# EAGLE design aquarium-controller-ultimate (EAGLE 6.1)
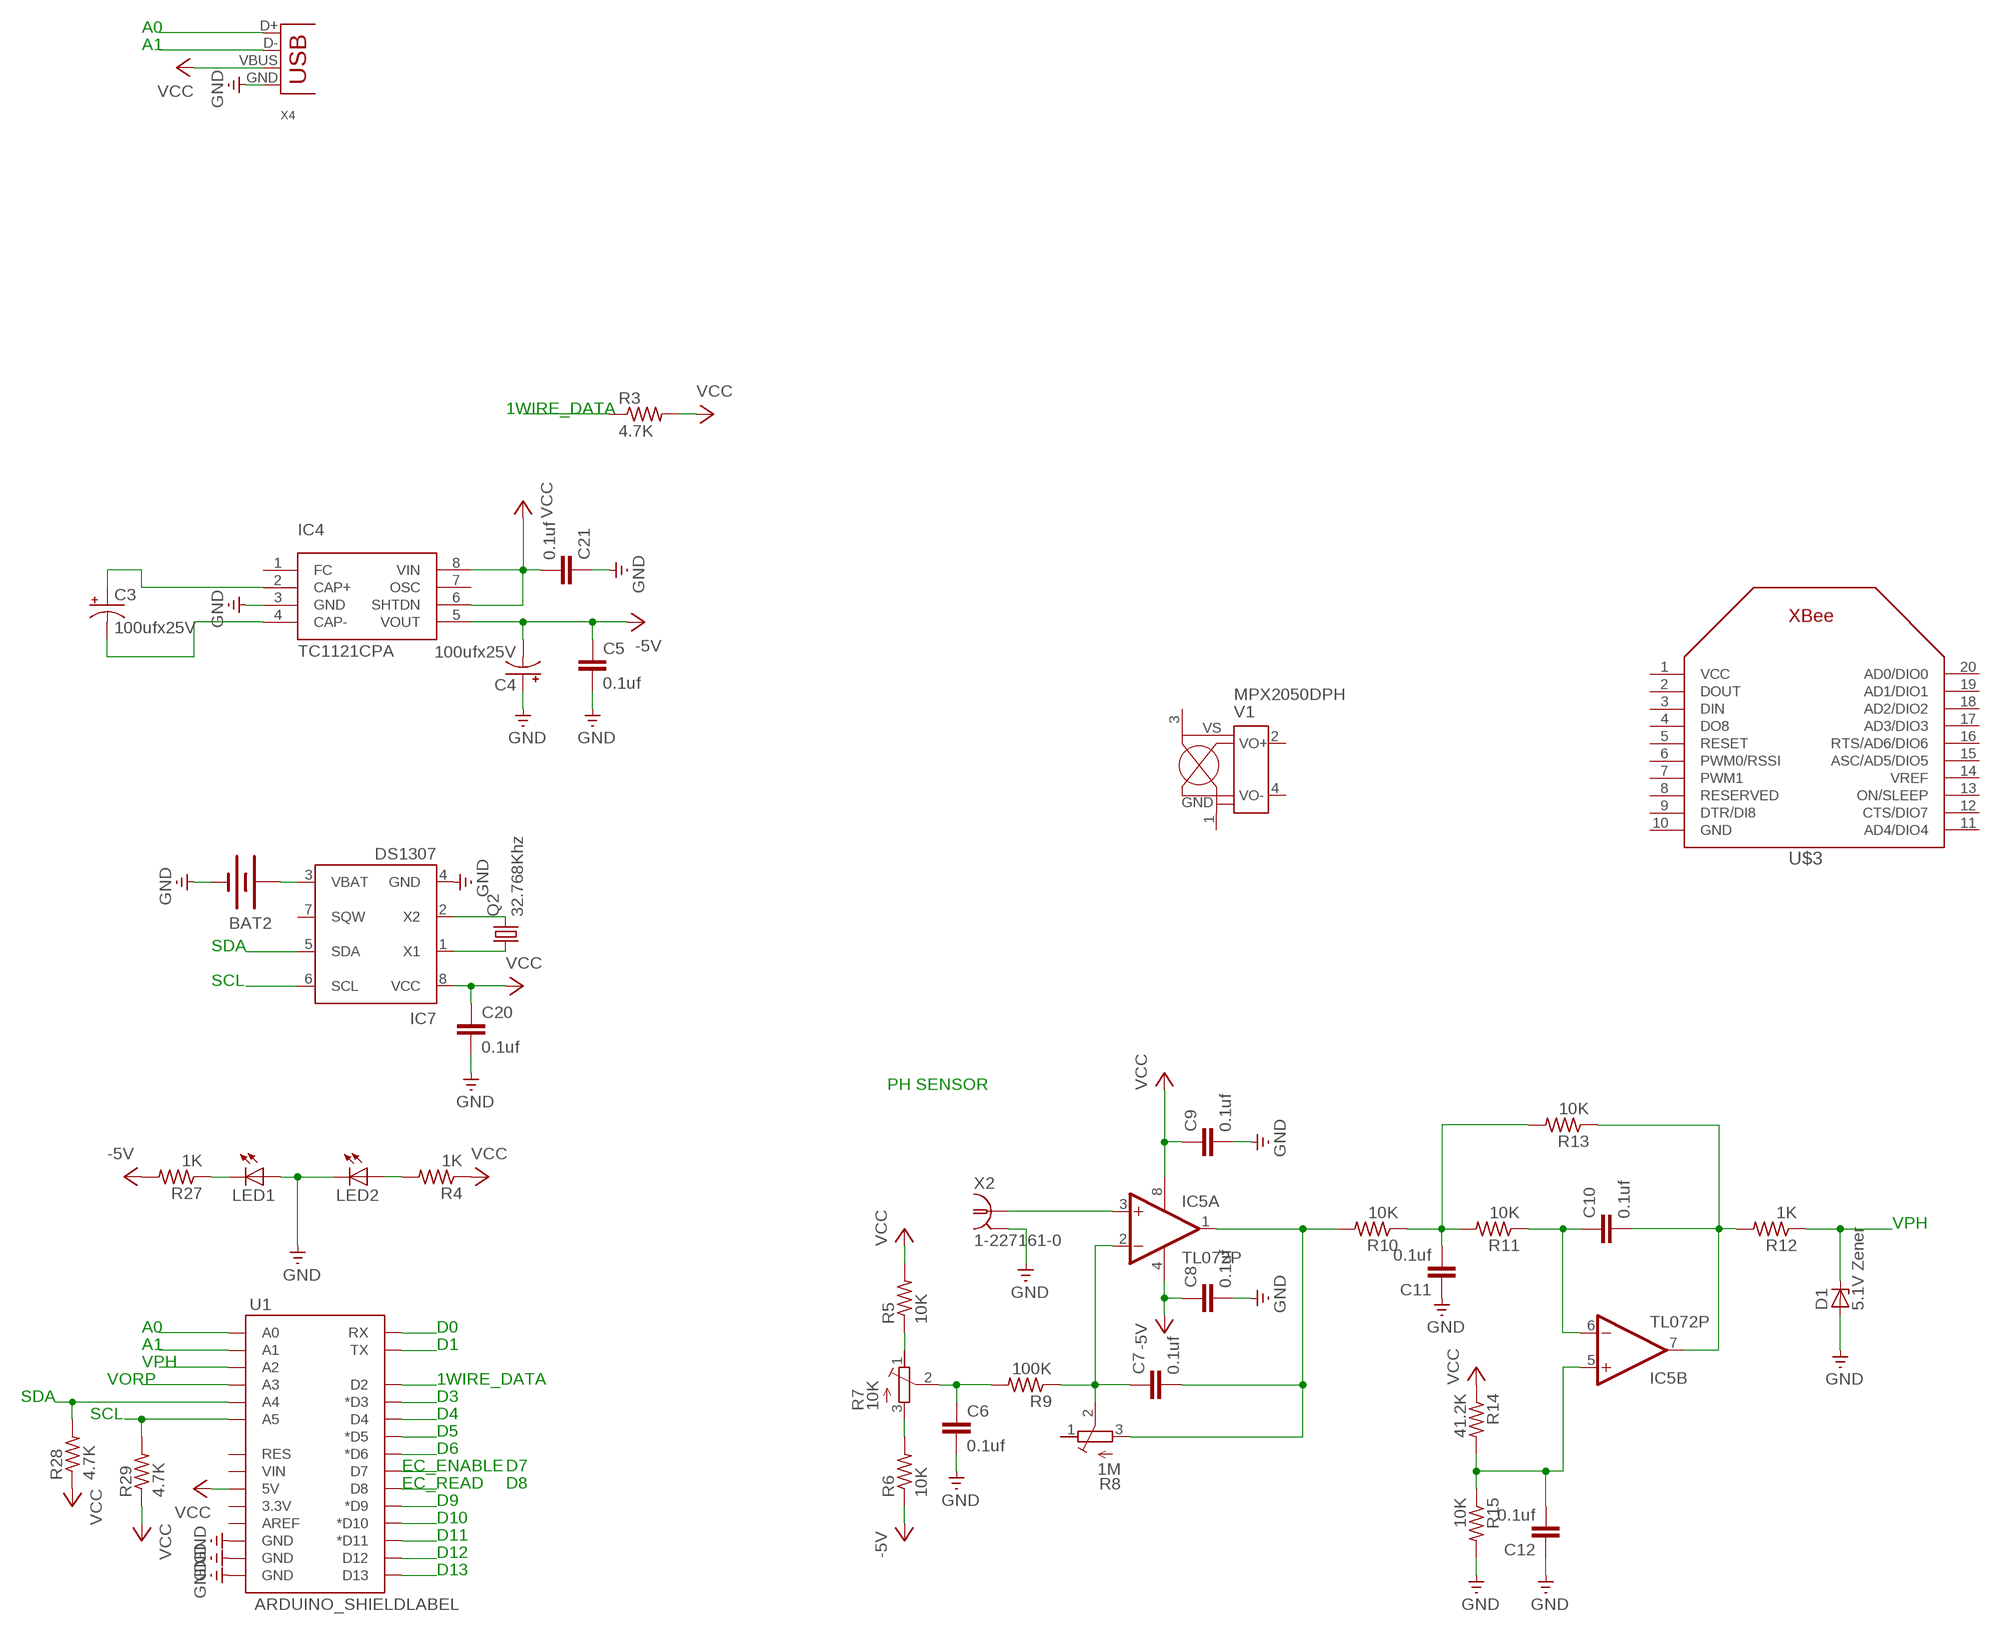
[diagram p0: schematic, sheet 1]

## Parts
BAT2  BATTERY20PTH  [BATTCOM_20MM_PTH]
C3  100ufx25V  CPOL-USE2.5-7  [E2,5-7]
C4  100ufx25V  CPOL-USE2.5-7  [E2,5-7]
C5  0.1uf  C-EU025-025X050  [C025-025X050]
C6  0.1uf  C-EU025-025X050  [C025-025X050]
C7  0.1uf  C-EU025-025X050  [C025-025X050]
C8  0.1uf  C-EU025-025X050  [C025-025X050]
C9  0.1uf  C-EU025-025X050  [C025-025X050]
C10  0.1uf  C-EU025-025X050  [C025-025X050]
C11  0.1uf  C-EU025-025X050  [C025-025X050]
C12  0.1uf  C-EU025-025X050  [C025-025X050]
C20  0.1uf  C-EU025-025X050  [C025-025X050]
C21  0.1uf  C-EU025-025X050  [C025-025X050]
D1  5.1V Zener  ZENER-DIODEDO35Z10  [DO35Z10]
IC4  TC1121CPA  [DIL8]
IC5  TL072P  [DIL08]
IC7  DS1307  [DIL08]
LED1  LED3MM  [LED3MM]
LED2  LED3MM  [LED3MM]
Q2  32.768Khz  CRYSTALTC38H  [TC38H]
R3  4.7K  R-US_0207/10  [0207/10]
R4  1K  R-US_0207/10  [0207/10]
R5  10K  R-US_0207/10  [0207/10]
R6  10K  R-US_0207/10  [0207/10]
R7  10K  R-TRIMM43P  [RTRIM43P]
R8  1M  R-TRIMM43P  [RTRIM43P]
R9  100K  R-US_0207/10  [0207/10]
R10  10K  R-US_0207/10  [0207/10]
R11  10K  R-US_0207/10  [0207/10]
R12  1K  R-US_0207/10  [0207/10]
R13  10K  R-US_0207/10  [0207/10]
R14  41.2K  R-US_0207/10  [0207/10]
R15  10K  R-US_0207/10  [0207/10]
R27  1K  R-US_0207/10  [0207/10]
R28  4.7K  R-US_0207/10  [0207/10]
R29  4.7K  R-US_0207/10  [0207/10]
U1  ARDUINO_SHIELDLABEL  [DUEMILANOVE_SHIELD]
U$3  XBEE  [XBEE]
V1  MPX2050DPH  [MPX2050DPH]
X2  1-227161-0  [AMP_227161]
X4  USB-A-H  [USB-A-H]

## Nets
1WIRE_DATA: R3.1 U1.D2
-5V: C4.- C5.1 C8.1 IC4.5(VOUT) IC5.4(P:V-) R6.1 R27.2
A0: U1.A0 X4.D+
A1: U1.A1 X4.D-
D0: U1.RX
D1: U1.TX
D3: U1.D3(*D3)
D4: U1.D4
D5: U1.D5(*D5)
D6: U1.D6(*D6)
D9: U1.D9(*D9)
D10: U1.D10(*D10)
D11: U1.D11(*D11)
D12: U1.D12
D13: U1.D13
ENABLE: U1.D7
GND: BAT2.2(-) C4.+ C5.2 C6.2 C8.2 C9.2 C11.1 C12.1 C20.2 C21.1 D1.A IC4.3(GND) IC7.4(GND) LED1.A LED2.K(C) R15.2 U1.GND@0(GND) U1.GND@1(GND) U1.GND@2(GND) X2.2(GND) X4.GND
N$2: LED2.A R4.2
N$3: LED1.K(C) R27.1
N$4: C3.+ IC4.2(CAP+)
N$5: C3.- IC4.4(CAP-)
N$16: R6.2 R7.3(E)
N$20: R5.1 R7.1(A)
N$21: C6.1 R7.2(S) R9.2
N$22: C7.1 IC5.2(A:-IN) R8.2(S) R9.1
N$23: C7.2 IC5.1(A:OUT) R8.3(E) R10.2
N$25: IC5.3(A:+IN) X2.1
N$27: C11.2 R10.1 R11.2 R13.2
N$28: C10.1 IC5.6(B:-IN) R11.1
N$29: C10.2 IC5.7(B:OUT) R12.2 R13.1
N$30: C12.2 IC5.5(B:+IN) R14.2 R15.1
N$39: IC7.2(X2) Q2.2
N$40: IC7.1(X1) Q2.1
N$41: BAT2.1(+) IC7.3(VBAT)
PROBE_2: U1.D8
SCL: IC7.6(SCL) R29.2 U1.A5
SDA: IC7.5(SDA) R28.2 U1.A4
VCC: C9.1 C20.1 C21.2 IC4.6(SHTDN) IC4.8(VIN) IC5.8(P:V+) IC7.8(VCC) R3.2 R4.1 R5.2 R14.1 R28.1 R29.1 U1.5V X4.VBUS
VORP: U1.A3
VPH: D1.C R12.1 U1.A2
Unconnected: IC4.1(FC) IC4.7(OSC) IC7.7(SQW) R8.1(A) U1.3.3V U1.AREF U1.RES U1.VIN U$3.1(VCC) U$3.2(DOUT) U$3.3(DIN) U$3.4(DO8) U$3.5(RESET) U$3.6(PWM0/RSSI) U$3.7(PWM1) U$3.8(RESERVED) U$3.9(DTR/DI8) U$3.10(GND) U$3.11(AD4/DIO4) U$3.12(CTS/DIO7) U$3.13(ON/SLEEP) U$3.14(VREF) U$3.15(ASC/AD5/DIO5) U$3.16(RTS/AD6/DIO6) U$3.17(AD3/DIO3) U$3.18(AD2/DIO2) U$3.19(AD1/DIO1) U$3.20(AD0/DIO0) V1.1(GND) V1.2(VO+) V1.3(VS) V1.4(VO-)

## Notes on the sheet
- A0
- A1
- 1WIRE_DATA
- SDA
- SCL
- PH SENSOR
- VPH
- A0 | D0
- A1 | D1
- VPH
- VORP | 1WIRE_DATA
- SDA | D3
- SCL | D4
- D5
- D6
- EC_ENABLE | D7
- EC_READ | D8
- D9
- D10
- D11
- D12
- D13

## Library data of the parts
BAT2 = SparkFun:BATTERY: Battery Holders Various common sizes : AA, AAA, 20mm coin cell and 12mm coin cell.
C3 C4 = rcl:CPOL-US: POLARIZED CAPACITOR, American symbol
C5-C12 C20 C21 = rcl:C-EU: CAPACITOR, European symbol
D1 = diode:ZENER-DIODE: Z-Diode
IC4 = tc1121:TC1121: Microchip - 100mA charge pump voltage converter with shutdown. It converts a 2.4V to 5.5V to a corresponding negative output voltage.
IC5 = linear:TL072: OP AMP
IC7 = ds1307_pcf8583:DS1307: I2C-Bus CLOCK/CALENDAR
LED1 LED2 = led:LED: LED OSRAM: - CHIPLED LG R971, LG N971, LY N971, LG Q971, LY Q971, LO R971, LY R971 LH N974, LH R974 LS Q976, LO Q976, LY Q976 LO Q996 - Hyper CHIPLED LW Q18S LB Q993, LB Q99A, LB R99A - SideLED LS A670, LO A670, LY A670, LG A670, LP A670 LB A673, LV A673, LT A673, LW A673 LH A674 LY A675 LS A676, LA A676, LO A676, LY A676, LW A676 LS A679, LY A679, LG A679 - Hyper Micro SIDELED® LS Y876, LA Y876, LO Y876, LY Y876 LT Y87S - SmartLED LW L88C, LW L88S LB L89C, LB L89S, LG L890 LS L89K, LO L89K, LY L89K LS L896, LA L896, LO L896, LY L896 - TOPLED LS T670, LO T670, LY T670, LG T670, LP T670 LSG T670, LSP T670, LSY T670, LOP T670, LYG T670 LG T671, LOG T671, LSG T671 LB T673, LV T673, LT T673, LW T673 LH T674 LS T676, LA T676, LO T676, LY T676, LB T676, LH T676, LSB T676, LW T676 LB T67C, LV T67C, LT T67C, LS T67K, LO T67K, LY T67K, LW E67C LS E67B, LA E67B, LO E67B, LY E67B, LB E67C, LV E67C, LT E67C LW T67C LS T679, LY T679, LG T679 LS T770, LO T770, LY T770, LG T770, LP T770 LB T773, LV T773, LT T773, LW T773 LH T774 LS E675, LA E675, LY E675, LS T675 LS T776, LA T776, LO T776, LY T776, LB T776 LHGB T686 LT T68C, LB T68C - Hyper Mini TOPLED® LB M676 - Mini TOPLED Santana® LG M470 LS M47K, LO M47K, LY M47K Source: http://www.osram.convergy.de LUXEON: - LUMILED® LXK2-PW12-R00, LXK2-PW12-S00, LXK2-PW14-U00, LXK2-PW14-V00 LXK2-PM12-R00, LXK2-PM12-S00, LXK2-PM14-U00 LXK2-PE12-Q00, LXK2-PE12-R00, LXK2-PE12-S00, LXK2-PE14-T00, LXK2-PE14-U00 LXK2-PB12-K00, LXK2-PB12-L00, LXK2-PB12-M00, LXK2-PB14-N00, LXK2-PB14-P00, LXK2-PB14-Q00 LXK2-PR12-L00, LXK2-PR12-M00, LXK2-PR14-Q00, LXK2-PR14-R00 LXK2-PD12-Q00, LXK2-PD12-R00, LXK2-PD12-S00 LXK2-PH12-R00, LXK2-PH12-S00 LXK2-PL12-P00, LXK2-PL12-Q00, LXK2-PL12-R00 Source: www.luxeon.com KINGBRIGHT: KA-3528ASYC Source: www.kingbright.com
Q2 = SparkFun:CRYSTAL: Crystals Various standard crystals. Proven footprints. Spark Fun Electronics SKU : COM-00534
R3-R6 R9-R15 R27-R29 = rcl:R-US_: RESISTOR, American symbol
R7 R8 = rcl:R-TRIMM: Trimm resistor
U1 = SparkFun-1:ARDUINO_SHIELD
U$3 = adafruit:XBEE
V1 = motorola-sensor-driver:MPX2050*: 50 kPa Pressure Sensor On-Chip Temparetur Compensated & Calibrated Silicon Pressure Sensor; OC_FARNELL: unknown; OC_NEWARK: unknown
X2 = con-coax:?227161*: JACK, RIGHT ANGLE, 50 OHM, PCB, BNC Source: amp_227161.pdf
X4 = con-usb-3:USB: USB Connectors

## Net classes
0 default: width 0.406 mm

## Board
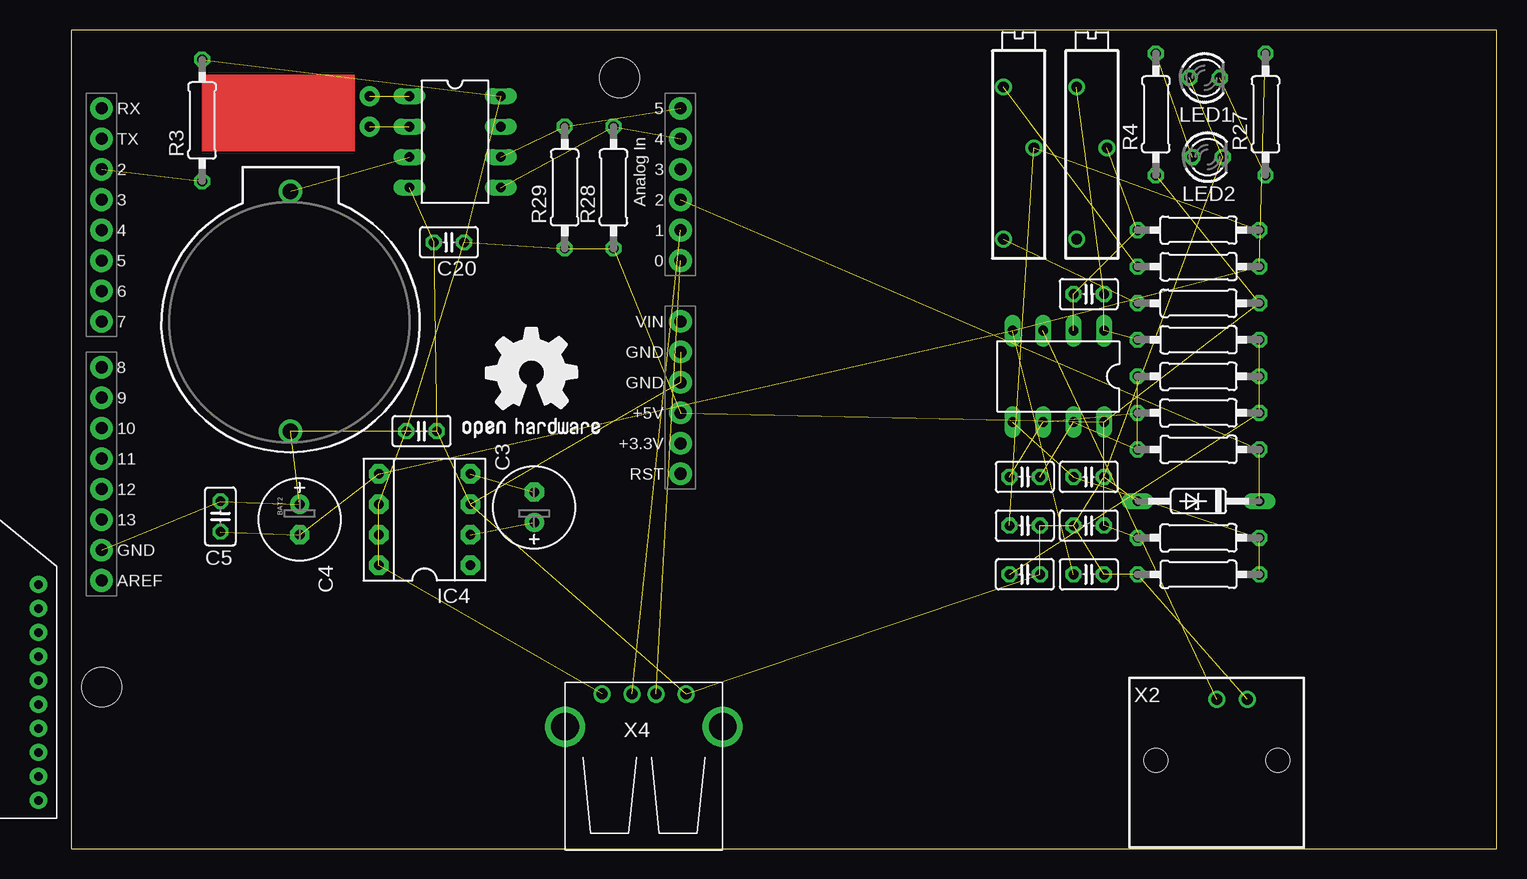
[diagram p1: board, top side]
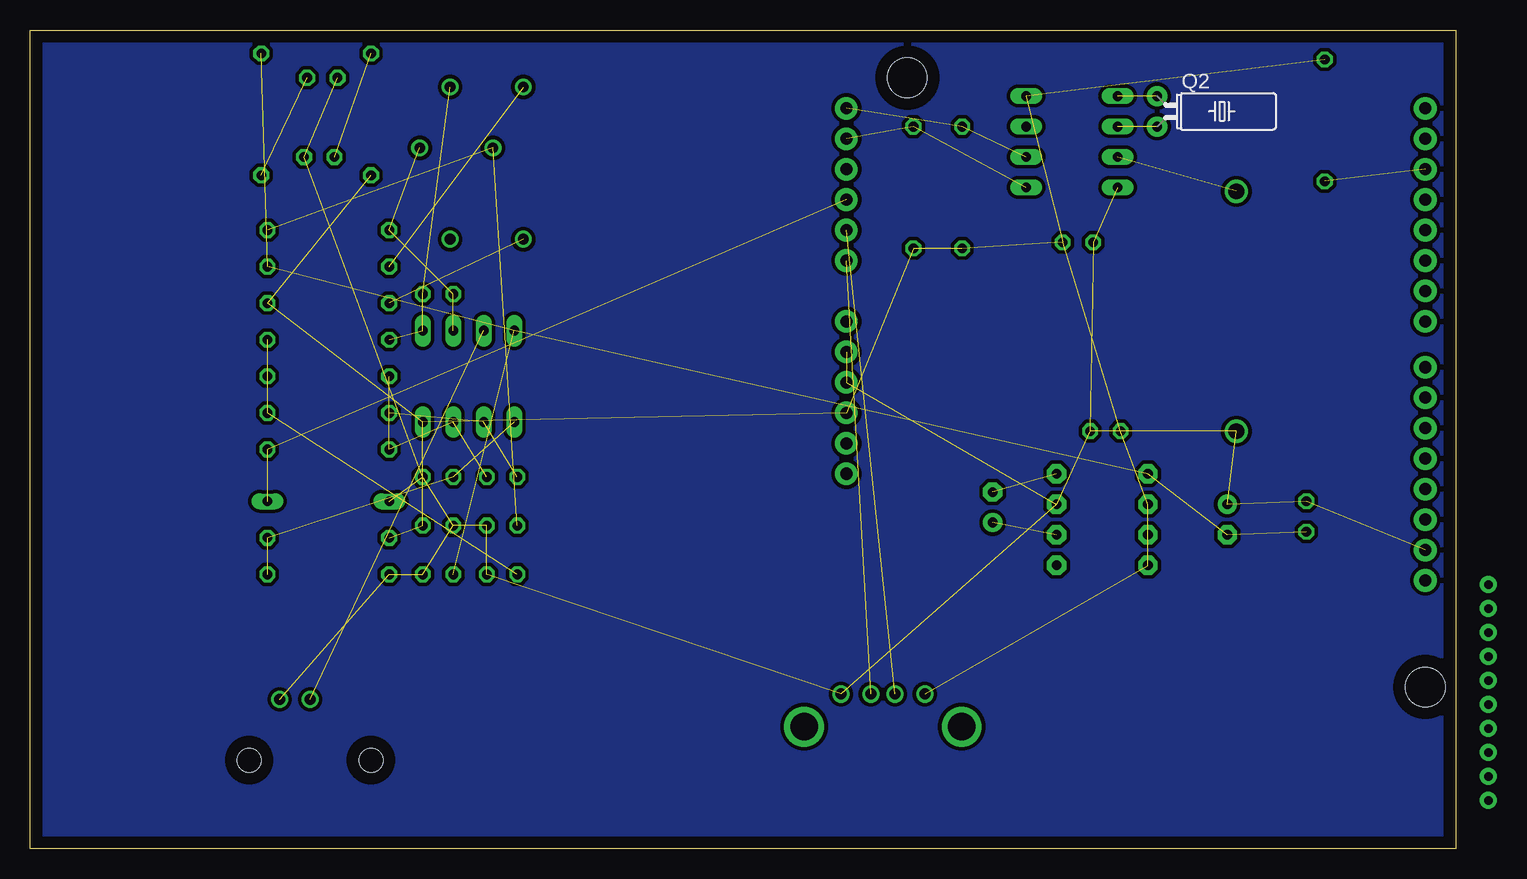
[diagram p2: board, bottom side, seen from below]

Size 118.85 x 68.25 mm. Coordinates in mm from the lower left corner, seen from the top.
Outline: 0,0 118.85,0 118.85,68.25 0,68.25 0,0
Copper layers (1*16): Top 0.035mm / dielectric 1.5mm / Bottom 0.035mm
Design rules: minimum track width 10mil, minimum drill 24mil, track to track 12mil, track to pad 12mil, pad to pad 12mil, via to via 12mil, smd to smd 8mil, copper to edge 40mil, drill to drill 8mil, minimum pad ring 10mil, minimum via ring 8mil, stop-mask expansion 4mil, vias tented up to drill 0mil, thermal gap 10mil

### Footprints (pad centres in the part's own frame; a part is rotated, then mirrored left to right if it is on the bottom)
BATTCOM_20MM_PTH = drill 1.3: 1 20,0; 2 0,0
E2,5-7 = drill 0.813 pad 1.6: + -1.27,0 | drill 0.813 pad 1.6 octagon: - 1.27,0
C025-025X050 = drill 0.813 octagon: 1 -1.27,0; 2 1.27,0
DO35Z10 = drill 0.813 long: A 5.08,0; C -5.08,0
DIL8 = drill 0.813 pad 1.6 octagon: 1 -3.81,-3.81; 2 -1.27,-3.81; 3 1.27,-3.81; 4 3.81,-3.81; 5 3.81,3.81; 6 1.27,3.81; 7 -1.27,3.81; 8 -3.81,3.81
DIL08 = drill 0.813 long: 1 -3.81,-3.81; 2 -1.27,-3.81; 3 1.27,-3.81; 4 3.81,-3.81; 5 3.81,3.81; 6 1.27,3.81; 7 -1.27,3.81; 8 -3.81,3.81
LED3MM = drill 0.813 octagon: A -1.27,0; K 1.27,0
TC38H = drill 0.813 pad 1.676: 1 -1.27,0; 2 1.27,0
0207/10 = drill 0.813 octagon: 1 -5.08,0; 2 5.08,0
RTRIM43P = drill 0.9: 1 -7.62,1.27; 2 0,-1.27; 3 5.08,1.27
DUEMILANOVE_SHIELD = drill 1.016 pad 1.88: 3.3V 50.8,22.86; 5V 50.8,25.4; A0 50.8,38.1; A1 50.8,40.64; A2 50.8,43.18; A3 50.8,45.72; A4 50.8,48.26; A5 50.8,50.8; AREF 2.54,11.43; D2 2.54,45.72; D3 2.54,43.18; D4 2.54,40.64; D5 2.54,38.1; D6 2.54,35.56; D7 2.54,33.02; D8 2.54,29.21; D9 2.54,26.67; D10 2.54,24.13; D11 2.54,21.59; D12 2.54,19.05; D13 2.54,16.51; GND@0 50.8,27.94; GND@1 50.8,30.48; GND@2 2.54,13.97; RES 50.8,20.32; RX 2.54,50.8; TX 2.54,48.26; VIN 50.8,33.02 | hole 3.302: 45.72,53.34; 2.54,2.54
XBEE = drill 0.7 pad 1.422 square: 1 -11,5.5 | drill 0.7 pad 1.422: 2 -11,3.5; 3 -11,1.5; 4 -11,-0.5; 5 -11,-2.5; 6 -11,-4.5; 7 -11,-6.5; 8 -11,-8.5; 9 -11,-10.5; 10 -11,-12.5; 11 11,-12.5; 12 11,-10.5; 13 11,-8.5; 14 11,-6.5; 15 11,-4.5; 16 11,-2.5; 17 11,-0.5; 18 11,1.5; 19 11,3.5; 20 11,5.5
MPX2050DPH = drill 0.6: 1 -3.81,-13.97; 2 -1.27,-13.97; 3 1.27,-13.97; 4 3.81,-13.97 | hole 4: 11.555,0; -11.555,0
AMP_227161 = drill 0.9 pad 1.27: 1 0,-5.08; 2 -2.54,-5.08 | hole 2: -5.08,0; 5.08,0
USB-A-H = drill 0.914: D+ 2.718,-1.003; D- 2.718,1.003; GND 2.718,-3.493; VBUS 2.718,3.493 | drill 2.311: P$5 0,-6.566; P$6 0,6.566

### Placement (x,y rotation side)
BAT2  18.29,34.8 90 top
C3  38.61,28.45 90 top
C4  19.05,27.43 270 top
C5  12.45,27.69 90 top
C6  79.5,26.92 0 top
C7  84.84,46.23 0 top
C8  84.84,22.86 0 top
C9  84.84,26.92 180 top
C10  79.5,30.99 0 top
C11  79.5,22.86 180 top
C12  84.84,30.99 180 top
C20  31.5,50.55 180 top
C21  29.21,34.8 180 top
D1  93.98,28.96 180 top
IC4  29.46,27.43 90 top
IC5  82.3,39.37 180 top
IC7  32,58.93 270 top
LED1  94.49,64.26 0 top
LED2  94.74,57.66 0 top
Q2  24.89,61.47 270 bottom
R3  10.92,60.71 90 top
R4  90.42,61.21 90 top
R5  93.98,45.47 0 top
R6  93.98,48.51 180 top
R7  78.99,58.42 90 top
R8  85.09,58.42 90 top
R9  93.98,51.56 0 top
R10  93.98,42.42 180 top
R11  93.98,36.32 0 top
R12  93.98,33.27 180 top
R13  93.98,39.37 0 top
R14  93.98,25.91 0 top
R15  93.98,22.86 180 top
R27  99.57,61.21 90 top
R28  45.21,55.12 90 top
R29  41.15,55.12 90 top
U1  0,10.92 0 top
U$2  [OSHW1]  32,32.51 0 top
U$3  -13.72,16.51 0 top
V1  -41.4,14.99 0 top  (outside the outline)
X2  95.5,7.37 180 top
X4  47.75,10.16 90 top

### Tracks (layer width: path | path; a pad name or v marks a point on that pad's centre or on a via)
1WIRE_DATA  (1 unrouted)
-5V  (6 unrouted)
A0  (1 unrouted)
A1  (1 unrouted)
GND  (20 unrouted)
N$1
  pour Bottom: 0.76,67.56 117.86,67.31 117.86,0.76 0.76,1.02
N$2  (1 unrouted)
N$3  (1 unrouted)
N$4  (1 unrouted)
N$5  (1 unrouted)
N$16  (1 unrouted)
N$20  (1 unrouted)
N$21  (2 unrouted)
N$22  (3 unrouted)
N$23  (3 unrouted)
N$25  (1 unrouted)
N$27  (3 unrouted)
N$28  (2 unrouted)
N$29  (3 unrouted)
N$30  (3 unrouted)
N$39  (1 unrouted)
N$40  (1 unrouted)
N$41  (1 unrouted)
SCL  (2 unrouted)
SDA  (2 unrouted)
VCC  (14 unrouted)
VPH  (2 unrouted)
(copper drawn outside any net)
  shapes: Top area x1

### Text on the board
tValues: Order of trimpots | <- | -> | GAIN | SLOPE | DIGITAL PWM -> | I2C | 1WIRE | ANALOG | PH/ORP | PH/ORP | EC | PROBE | PROBE | SHIELD